# EAGLE design breakout-rv-rtc (EAGLE 7.5.0)
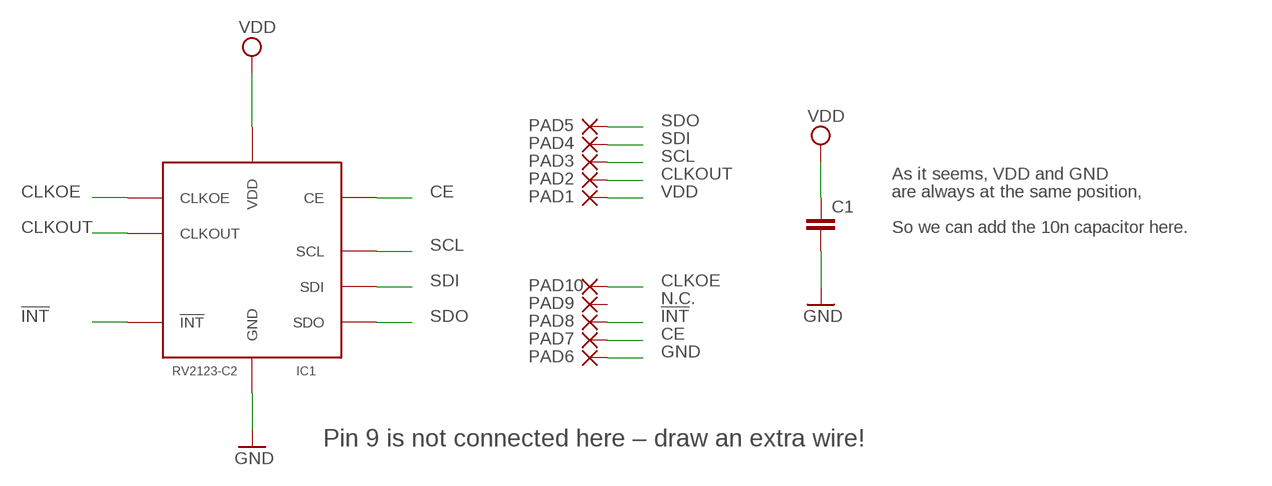
[diagram p0: schematic, sheet 1]

## Parts
C1  C-EUC0805K  [C0805K]
IC1  RV2123-C2  [SON_10-PIN]
PAD1  1,6/0,8  [1,6/0,8]
PAD2  1,6/0,8  [1,6/0,8]
PAD3  1,6/0,8  [1,6/0,8]
PAD4  1,6/0,8  [1,6/0,8]
PAD5  1,6/0,8  [1,6/0,8]
PAD6  1,6/0,8  [1,6/0,8]
PAD7  1,6/0,8  [1,6/0,8]
PAD8  1,6/0,8  [1,6/0,8]
PAD9  1,6/0,8  [1,6/0,8]
PAD10  1,6/0,8  [1,6/0,8]

## Nets
!INT: IC1.P.8(!INT) PAD8.1(P)
CE: IC1.P.7(CE) PAD7.1(P)
CLKOE: IC1.P.10(CLKOE) PAD10.1(P)
CLKOUT: IC1.P.2(CLKOUT) PAD2.1(P)
GND: C1.2 IC1.P.6(GND) PAD6.1(P)
SCL: IC1.P.3(SCL) PAD3.1(P)
SDI: IC1.P.4(SDI) PAD4.1(P)
SDO: IC1.P.5(SDO) PAD5.1(P)
VDD: C1.1 IC1.P.1(VDD) PAD1.1(P)
Unconnected: PAD9.1(P)

## Notes on the sheet
- As it seems, VDD and GND
- are always at the same position,
- So we can add the 10n capacitor here.
- N.C.
- Pin 9 is not connected here – draw an extra wire!

## Library data of the parts
C1 = resistor:C-EU: CAPACITOR, European symbol
IC1 = n39:RV2123-C2: RV 2123-C2: Real Time Clock Module with SPI Bus This RTC IC has been specially designed to achieve an ultra-low power consumption of typically 130nA @ VDD 3.0V in time-keeping mode. The very small SMT ceramic-package combines the 32.768 kHz crystal unit with the CMOS-based oscillator and real-time-clock circuitry. The calendar function tracks year, month, date, and day-of-the-week with built-in century and leap-year flags. The clock function tracks minute and second in 24-hour format. Programmable alarm setting and universal timer functions increase flexibility. This parts comes with visible VCC and GND pins to facilitate battery-backup schematics.; REICHELT: RV 2123-C2
PAD1-PAD10 = wirepad:1,6/0,8: THROUGH-HOLE PAD

## Board
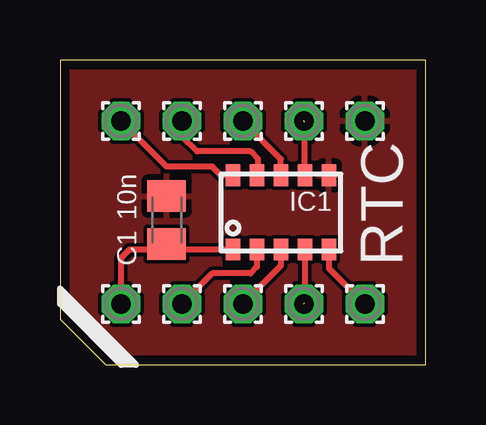
[diagram p1: board, top side]
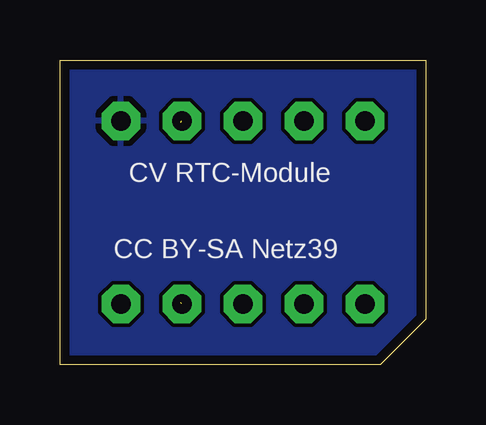
[diagram p2: board, bottom side, seen from below]

Size 15.24 x 12.7 mm. Coordinates in mm from the lower left corner, seen from the top.
Outline: 1.91,0 15.24,0 15.24,12.7 0,12.7 0,1.91 1.91,0
Copper layers (1*16): Top 0.0356mm / dielectric 1.5011mm / Bottom 0.0356mm
Design rules "LaenPCBOrder": minimum track width 6mil, minimum drill 13mil, track to track 6mil, track to pad 6mil, pad to pad 6mil, via to via 6mil, smd to smd 6mil, copper to edge 15mil, drill to drill 6mil, minimum pad ring 7mil, minimum via ring 7mil, stop-mask expansion 3mil, vias tented up to drill 0mil, thermal gap 10mil

### Footprints (pad centres in the part's own frame; a part is rotated, then mirrored left to right if it is on the bottom)
C0805K = smd 1.3 x 1.6: 1 -1,0; 2 1,0
SON_10-PIN = smd 0.6 x 0.9: P.1 -2,-1.55; P.2 -1,-1.55; P.3 0,-1.55; P.4 1,-1.55; P.5 2,-1.55; P.6 2,1.55; P.7 1,1.55; P.8 0,1.55; P.9 -1,1.55; P.10 -2,1.55
1,6/0,8 = drill 0.813 pad 1.6 octagon: 1 0,0

### Placement (x,y rotation side)
C1  4.45,6.03 90 top
IC1  9.21,6.35 0 top
PAD1  2.54,2.54 0 top
PAD2  5.08,2.54 0 top
PAD3  7.62,2.54 0 top
PAD4  10.16,2.54 0 top
PAD5  12.7,2.54 0 top
PAD6  12.7,10.16 0 top
PAD7  10.16,10.16 0 top
PAD8  7.62,10.16 0 top
PAD9  5.08,10.16 0 top
PAD10  2.54,10.16 0 top

### Tracks (layer width: path | path; a pad name or v marks a point on that pad's centre or on a via)
!INT
  Top 0.254: IC1.P.8 9.21,8.57 PAD8.1
CE  (1 unrouted)
  Top 0.254: IC1.P.7 10.21,10.11
CLKOE
  Top 0.254: IC1.P.10 6.71,7.9 6.35,8.26 4.45,8.26 PAD10.1
CLKOUT
  Top 0.254: IC1.P.2 8.21,4.08 7.94,3.81 6.35,3.81 PAD2.1
GND
  pour Bottom: 0,12.7 0,0 15.24,0 15.24,12.7
  pour Top: 0,12.7 0,0 15.24,0 15.24,12.7
N$2
  Top 0.254: 8.26,7.94 8.26,8.57 7.94,8.89 5.71,8.89 5.08,9.53
SCL
  Top 0.254: IC1.P.3 9.21,4.13 PAD3.1
SDI  (1 unrouted)
  Top 0.254: IC1.P.4 10.21,2.59
SDO
  Top 0.254: IC1.P.5 11.21,4.03 PAD5.1
VDD
  Top 0.254: IC1.P.1 4.45,4.8 | 4.45,4.8 2.9,4.8 2.54,4.45 PAD1.1 | C1.1 4.45,4.8

### Text on the board
tNames: 10n | RTC
bNames: CV RTC-Module | CC BY-SA Netz39